# EAGLE schematic PDB2019 (EAGLE 8.7.1)
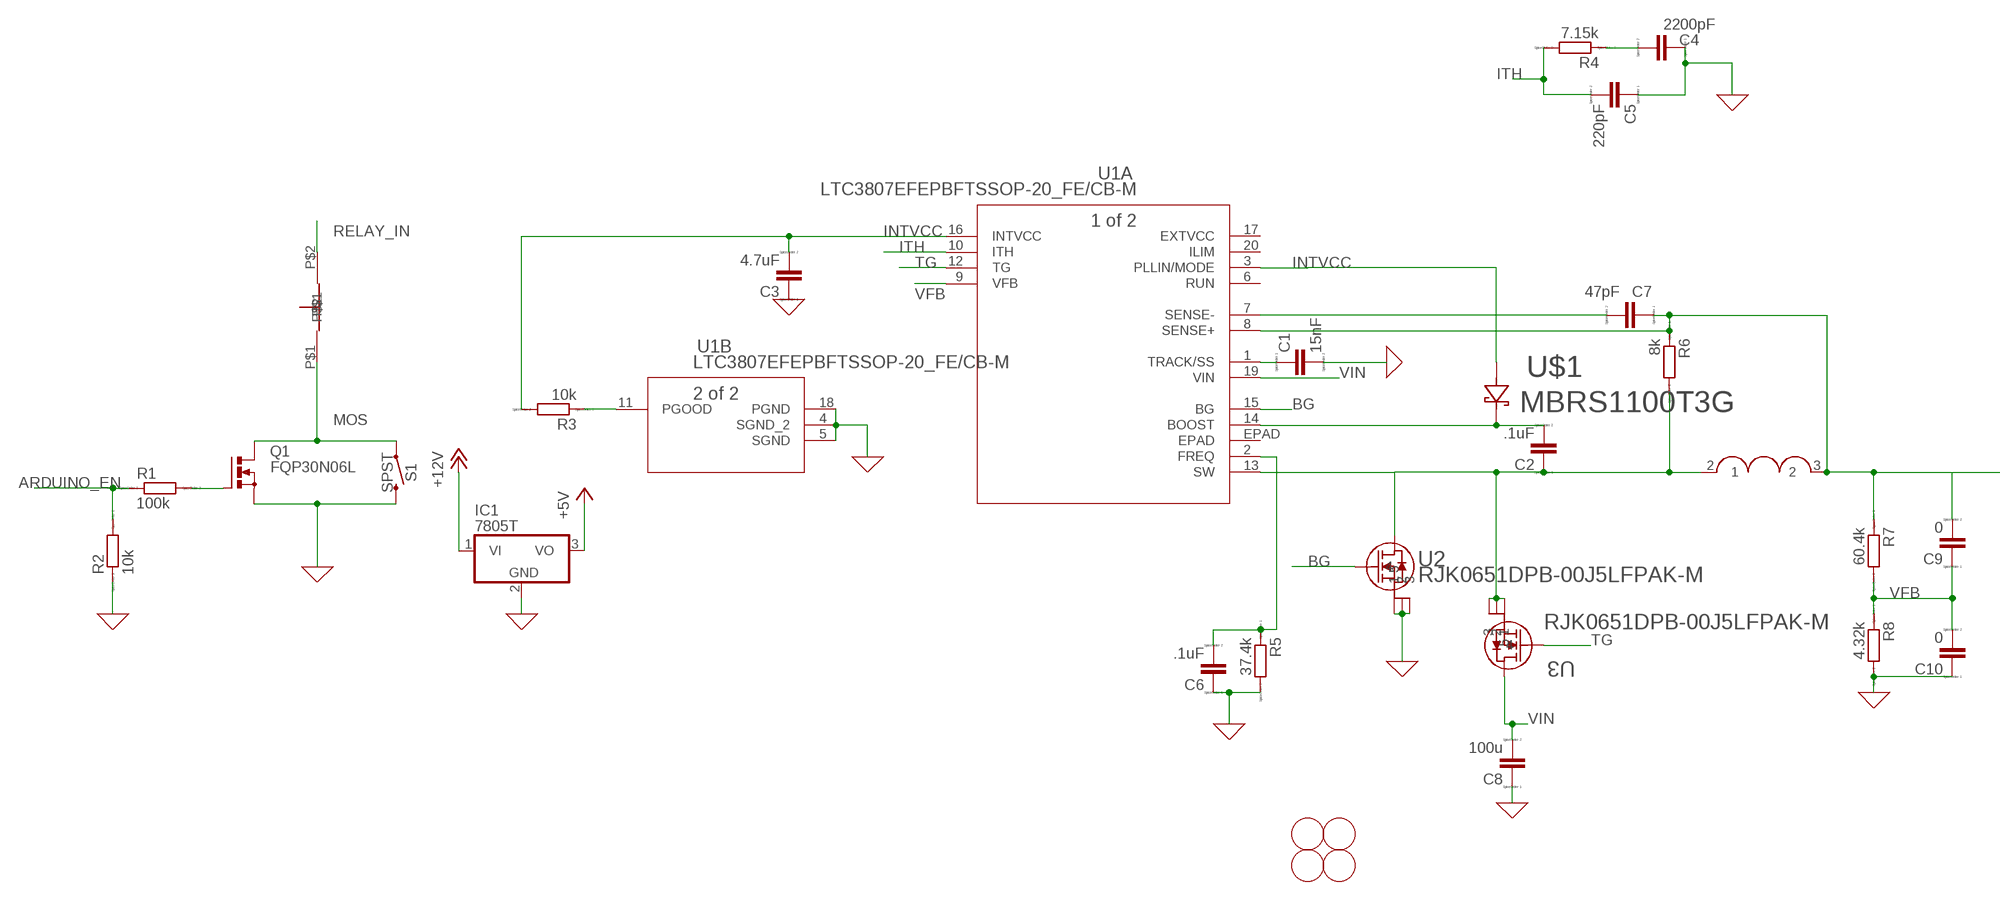
[diagram p0: schematic, sheet 1, part 1 of 2]
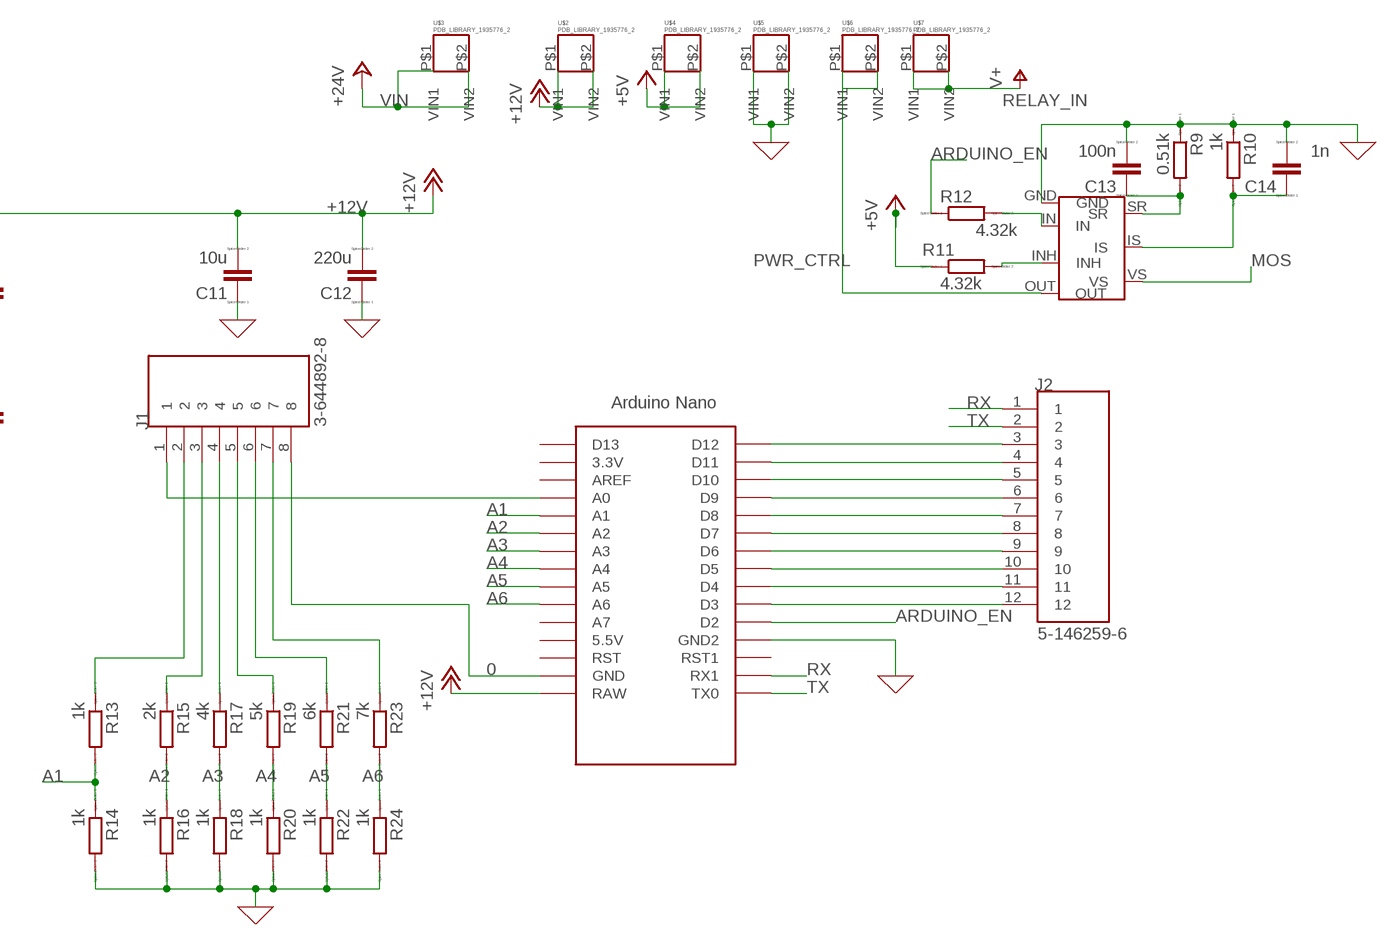
[diagram p1: schematic, sheet 1, part 2 of 2]

## Parts
C1  15nF  CC1206  [C1206]
C2  .1uF  CC1206  [C1206]
C3  4.7uF  CC1206  [C1206]
C4  2200pF  CC1206  [C1206]
C5  220pF  CC1206  [C1206]
C6  .1uF  CC1206  [C1206]
C7  47pF  CC1206  [C1206]
C8  100u  CC1206  [C1206]
C9  0  CC1206  [C1206]
C10  0  CC1206  [C1206]
C11  10u  CC1206  [C1206]
C12  220u  CC1206  [C1206]
C13  100n  CC1206  [C1206]
C14  1n  CC1206  [C1206]
IC1  7805T  [TO220H]
J1  3-644892-8  [TE_3-644892-8]
J2  5-146259-6  [TE_5-146259-6]
L1  INDUCT_MOONROCK  [INDUCT_MOONROCK]
Q1  FQP30N06L  BUZ11BV  [TO220BV]
R1  100k  R0207/10  [0207/10]
R2  10k  R0207/10  [0207/10]
R3  10k  R0207/10  [0207/10]
R4  7.15k  RR1210  [R1210]
R5  37.4k  RR1210  [R1210]
R6  8k  RR1210  [R1210]
R7  60.4k  RR1210  [R1210]
R8  4.32k  RR1210  [R1210]
R9  0.51k  RR1210  [R1210]
R10  1k  RR1210  [R1210]
R11  4.32k  RR1210  [R1210]
R12  4.32k  RR1210  [R1210]
R13  1k  RR1210  [R1210]
R14  1k  RR1210  [R1210]
R15  2k  RR1210  [R1210]
R16  1k  RR1210  [R1210]
R17  4k  RR1210  [R1210]
R18  1k  RR1210  [R1210]
R19  5k  RR1210  [R1210]
R20  1k  RR1210  [R1210]
R21  6k  RR1210  [R1210]
R22  1k  RR1210  [R1210]
R23  7k  RR1210  [R1210]
R24  1k  RR1210  [R1210]
S1  SPST  MOMENTARY-SWITCH-SPST-PTH-6.0MM-KIT  [TACTILE_SWITCH_PTH_6.0MM_KIT]
SW1  SPSTSWITCH  [2HOLES]
U1  LTC3807EFEPBFTSSOP-20_FE/CB-M  [TSSOP-20_FE/CB-M]
U2  RJK0651DPB-00J5LFPAK-M  [LFPAK-M]
U3  RJK0651DPB-00J5LFPAK-M  [LFPAK-M]
U4  BTN8982TA  [TO-263-8]
U$1  MBRS1100T3G  [SMB]
U$2  PDB_LIBRARY_1935776_2  [PDB_LIBRARY_PT2,5/2-5,0-H_2]
U$3  PDB_LIBRARY_1935776_2  [PDB_LIBRARY_PT2,5/2-5,0-H_2]
U$4  PDB_LIBRARY_1935776_2  [PDB_LIBRARY_PT2,5/2-5,0-H_2]
U$5  PDB_LIBRARY_1935776_2  [PDB_LIBRARY_PT2,5/2-5,0-H_2]
U$6  PDB_LIBRARY_1935776_2  [PDB_LIBRARY_PT2,5/2-5,0-H_2]
U$7  PDB_LIBRARY_1935776_2  [PDB_LIBRARY_PT2,5/2-5,0-H_2]
U$8  NANO  [NANO]
U$9  MOUNTINGHOLES  [MOUNTINGHOLES]

## Nets
0: C1.2 C3.1 C4.1 C5.1 C6.1 C8.1 C10.1 C11.1 C12.1 C13.2 C14.2 IC1.2(GND) J1.8 Q1.S R2.1 R5.2 R8.2 R9.1 R10.1 R14.2 R16.2 R18.2 R20.2 R22.2 R24.2 S1.3 U1.4(B:SGND_2) U1.5(B:SGND) U1.18(B:PGND) U2.1 U2.2 U2.3 U4.GND U$5.P$1(VIN1) U$5.P$2(VIN2) U$8.GND U$8.GND1(GND2) ; supply symbol labelled GND
+5V: IC1.3(VO) R11.1 U$4.P$1(VIN1) U$4.P$2(VIN2)
+12V: C7.1 C9.2 C11.2 C12.2 IC1.1(VI) L1.3 R6.1 R7.1 U1.8(A:SENSE+) U$2.P$1(VIN1) U$2.P$2(VIN2) U$8.RAW
A1: R13.2 R14.1 U$8.A1
A2: R15.2 R16.1 U$8.A2
A3: R17.2 R18.1 U$8.A3
A4: R19.2 R20.1 U$8.A4
A5: R21.2 R22.1 U$8.A5
A6: R23.2 R24.1 U$8.A6
ARDUINO_EN: R1.1 R2.2 R12.1 U$8.D2
BG: U1.15(A:BG) U2.4
INTVCC: C3.2 R3.2 U1.3(A:PLLIN/MODE) U1.16(A:INTVCC) U$1.2
ITH: C5.2 R4.2 U1.10(A:ITH)
MOS: Q1.D S1.1 SW1.P$1 U4.VS
N$1: J1.1 U$8.A0
N$2: Q1.G R1.2
N$3: C1.1 U1.1(A:TRACK/SS)
N$4: R11.2 U4.INH
N$5: J2.12 U$8.D3
N$6: C2.2 U1.14(A:BOOST) U$1.1
N$7: C2.1 L1.2 R6.2 U1.13(A:SW) U2.5 U3.1 U3.2 U3.3
N$8: R3.1 U1.11(B:PGOOD)
N$9: C4.2 R4.1
N$10: C6.2 R5.1 U1.2(A:FREQ)
N$11: C7.2 U1.7(A:SENSE-)
N$12: R12.2 U4.IN
N$13: C14.1 R10.2 U4.IS
N$14: C13.1 R9.2 U4.SR
N$15: J2.11 U$8.D4
N$16: J2.10 U$8.D5
N$17: J2.9 U$8.D6
N$18: J2.8 U$8.D7
N$19: J2.7 U$8.D8
N$20: J2.6 U$8.D9
N$21: J1.2 R13.1
N$22: J1.3 R15.1
N$23: J1.4 R17.1
N$24: J1.5 R19.1
N$25: J1.6 R21.1
N$26: J1.7 R23.1
N$28: J2.5 U$8.D10
N$29: J2.4 U$8.D11
N$30: J2.3 U$8.D12
PWR_CTRL: U4.OUT U$6.P$1(VIN1) U$6.P$2(VIN2)
RELAY_IN: SW1.P$2 U$7.P$1(VIN1) U$7.P$2(VIN2) ; supply symbol labelled V+
RX: J2.1 U$8.RX1
TG: U1.12(A:TG) U3.4
TX: J2.2 U$8.TX0
VFB: C9.1 C10.2 R7.2 R8.1 U1.9(A:VFB)
VIN: C8.2 U1.19(A:VIN) U3.5 U$3.P$1(VIN1) U$3.P$2(VIN2) ; supply symbol labelled +24V
Unconnected: U1.6(A:RUN) U1.17(A:EXTVCC) U1.20(A:ILIM) U1.EPAD(A:EPAD) U$8.3.3V U$8.5V(5.5V) U$8.A7 U$8.AREF U$8.D13 U$8.ICSP1 U$8.ICSP2 U$8.ICSP3 U$8.ICSP4 U$8.ICSP5 U$8.ICSP6 U$8.RST U$8.RST1

## Library data of the parts
C1-C14 = eagle-ltspice:C: CAPACITOR, European symbol; SPICEMODEL: NONE; SPICEPREFIX: C
IC1 = linear:78*: Positive VOLTAGE REGULATOR Source: http://cache.national.com/ds/LM/LM78L05.pdf http://www.fairchildsemi.com/ds/LM/LM7805.pdf
J1 = 3-644892-8:3-644892-8: 05P CST100 SHRD HDR ASSY WOPEG; CENTERLINE_PITCH: 2.54 mm[.1 in]; COMMENT: 3-644892-8; DESCRIPTION: 08P CST100 SHRD HDR ASSY LF; DIGI-KEY_PART_NUMBER: A108137-ND; DIGI-KEY_PURCHASE_URL: https://www.digikey.com/product-detail/en/te-connectivity-amp-connectors/3-644892-8/A108137-ND/4022249?utm_source=snapeda&utm_medium=aggregator&utm_campaign=symbol; EU_ROHS_COMPLIANCE: Compliant; MF: TE Connectivity; MP: 3-644892-8; NUMBER_OF_POSITIONS: 8; PACKAGE: None; PRODUCT_TYPE: Connector; TE_PURCHASE_URL: https://www.te.com/usa-en/product-3-644892-8.html?te_bu=Cor&te_type=disp&te_campaign=seda_glo_cor-seda-global-disp-prtnr-fy19-seda-model-bom-cta_sma-317_1&elqCampaignId=32493
J2 = 5-146259-6:5-146259-6; COMMENT: 5-146259-6; DESCRIPTION: AMPMODU 12 Position Through-Hole Dual Row Straight .100 Inch Breakaway Header; DIGI-KEY_PART_NUMBER: 5-146259-6-ND; DIGI-KEY_PURCHASE_URL: https://www.digikey.com/product-detail/en/te-connectivity-amp-connectors/5-146259-6/5-146259-6-ND/1150865?utm_source=snapeda&utm_medium=aggregator&utm_campaign=symbol; EU_ROHS_COMPLIANCE: Compliant; MF: TE Connectivity; MP: 5-146259-6; PACKAGE: None; TE_PURCHASE_URL: https://www.te.com/usa-en/product-5-146259-6.html?te_bu=Cor&te_type=disp&te_campaign=seda_glo_cor-seda-global-disp-prtnr-fy19-seda-model-bom-cta_sma-317_1&elqCampaignId=32493
L1 = My_lbr:INDUCT_MOONROCK
Q1 = transistor-power:BUZ11: N-CHANNEL MOS FET
R1-R24 = eagle-ltspice:R: RESISTOR, European symbol; SPICEMODEL: NONE; SPICEPREFIX: R
S1 = SparkFun-Switches:MOMENTARY-SWITCH-SPST: Momentary Switch (Pushbutton) - SPST Normally-open (NO) SPST momentary switches (buttons, pushbuttons). Variants PTH-12MM - 12mm square, through-hole Momentary Pushbutton Switch - 12mm Square <https://www.sparkfun.com/products/9190> (COM-09190) PTH-6.0MM, PTH-6.0MM-KIT - 6.0mm square, through-hole Mini Pushbutton Switch <https://www.sparkfun.com/products/97> (COM-00097) KIT package intended for soldering kit's - only one side of pads' copper is exposed. PTH-RIGHT-ANGLE-KIT - Right-angle, through-hole Right Angle Tactile Button <https://www.sparkfun.com/products/10791> - Used on SparkFun BigTime Watch Kit <https://www.sparkfun.com/products/11734> SMD-12MM - 12mm square, surface-mount Tactile Button - SMD (12mm) <https://www.sparkfun.com/products/12993> (COM-12993) Used on SparkFun PicoBoard <https://www.sparkfun.com/products/11888> SMD-4.5MM - 4.5mm Square Trackball Switch Used on SparkFun Blackberry Trackballer Breakout <https://www.sparkfun.com/products/13169> SMD-4.6MMX2.8MM - 4.60mm x 2.80mm, surface mount Used on SparkFun SAMD21 Mini Breakout <https://www.sparkfun.com/products/13664> SMD-5.2MM, SMD-5.2-REDUNDANT - 5.2mm square, surface-mount Mini Pushbutton Switch - SMD <https://www.sparkfun.com/products/8720> (COM-08720) Used on Arduino Pro Mini <https://www.sparkfun.com/products/11114> REDUNDANT package connects both switch circuits together SMD-6.0X3.5MM - 6.0 x 3.5mm, surface mount Momentary Reset Switch SMD <https://www.sparkfun.com/products/8229> (COM-08229) SMD-6.2MM-TALL - 6.2mm square, surface mount Tactile Button - SMD (6mm) <https://www.sparkfun.com/products/12992> Used on SparkFun Digital Sandbox <https://www.sparkfun.com/products/12651> SMD-RIGHT-ANGLE - Right-angle, surface mount Used on SparkFun Block for Intel® Edison - Arduino <https://www.sparkfun.com/products/13036>; PROD_ID: SWCH-08441; SF_SKU: COM-00097
SW1 = My_lbr:SPSTSWITCH
U1 = 12buck:LTC3807EFEPBF; MANUFACTURER_PART_NUMBER: LTC3807EFE#PBF; VENDOR: Linear Technology
U2 U3 = My_lbr:RJK0651DPB-00J5; MANUFACTURER_PART_NUMBER: RJK0651DPB00#J5; VENDOR: Renesas Electronics
U4 = My_lbr:BTN8982TA
U$1 = My_lbr:MBRS1100T3G; MANUFACTURER_PART_NUMBER: MBRS1100T3G; VENDOR: ON Semiconductor
U$2-U$7 = PDB_schematic3_MOSFET:PDB_LIBRARY_1935776_2
U$8 = Arduino-clone:NANO: Arduino Nano
U$9 = Holes:MOUNTINGHOLES